# Altium schematic sheet FPGA1.SchDoc
size A1
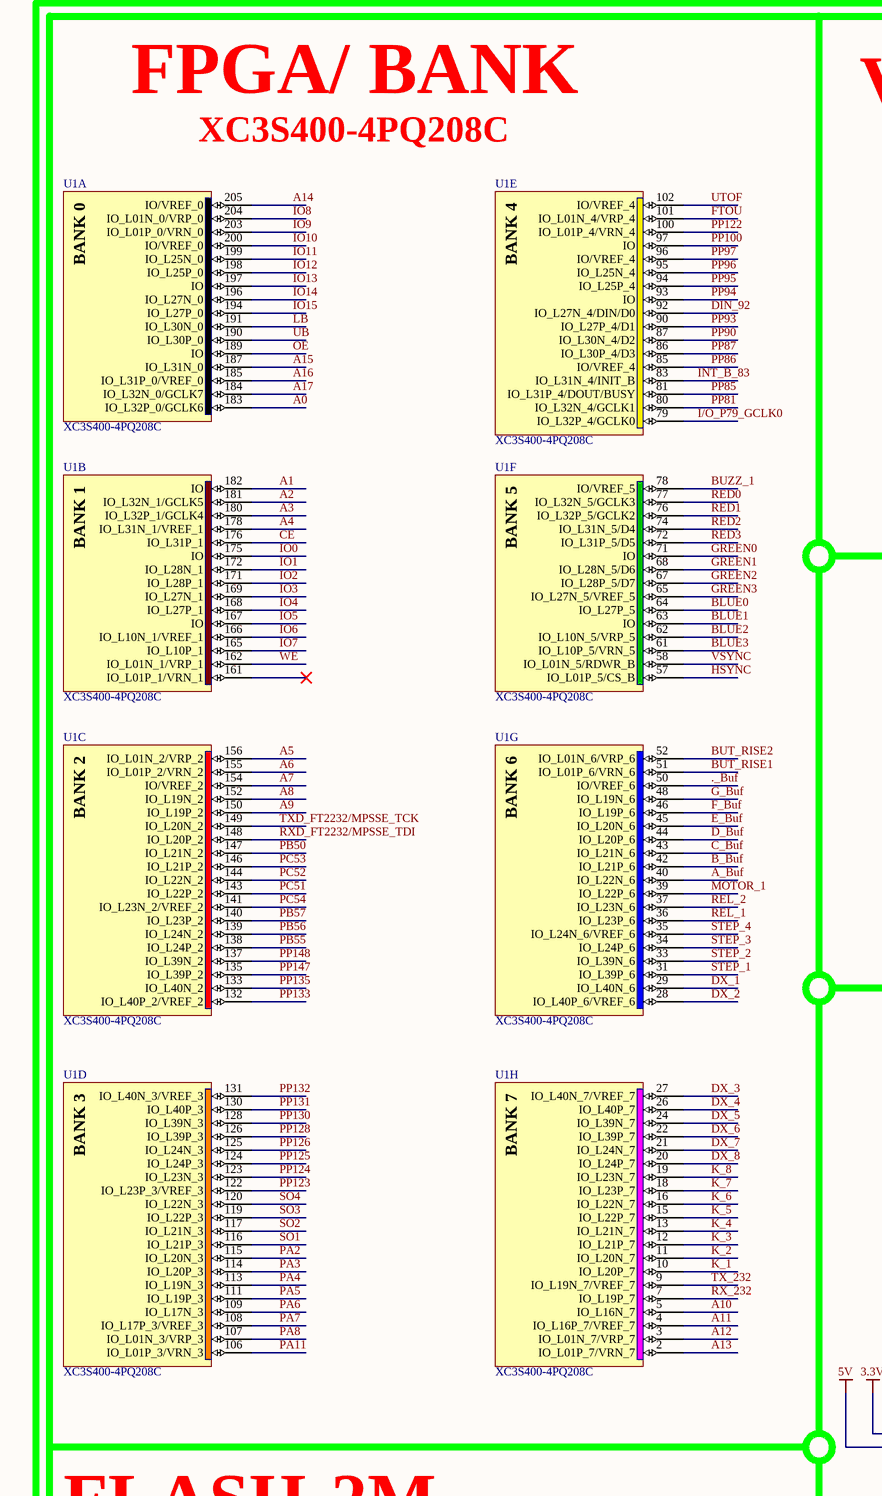
[diagram p0: FPGA1.SchDoc, top left]
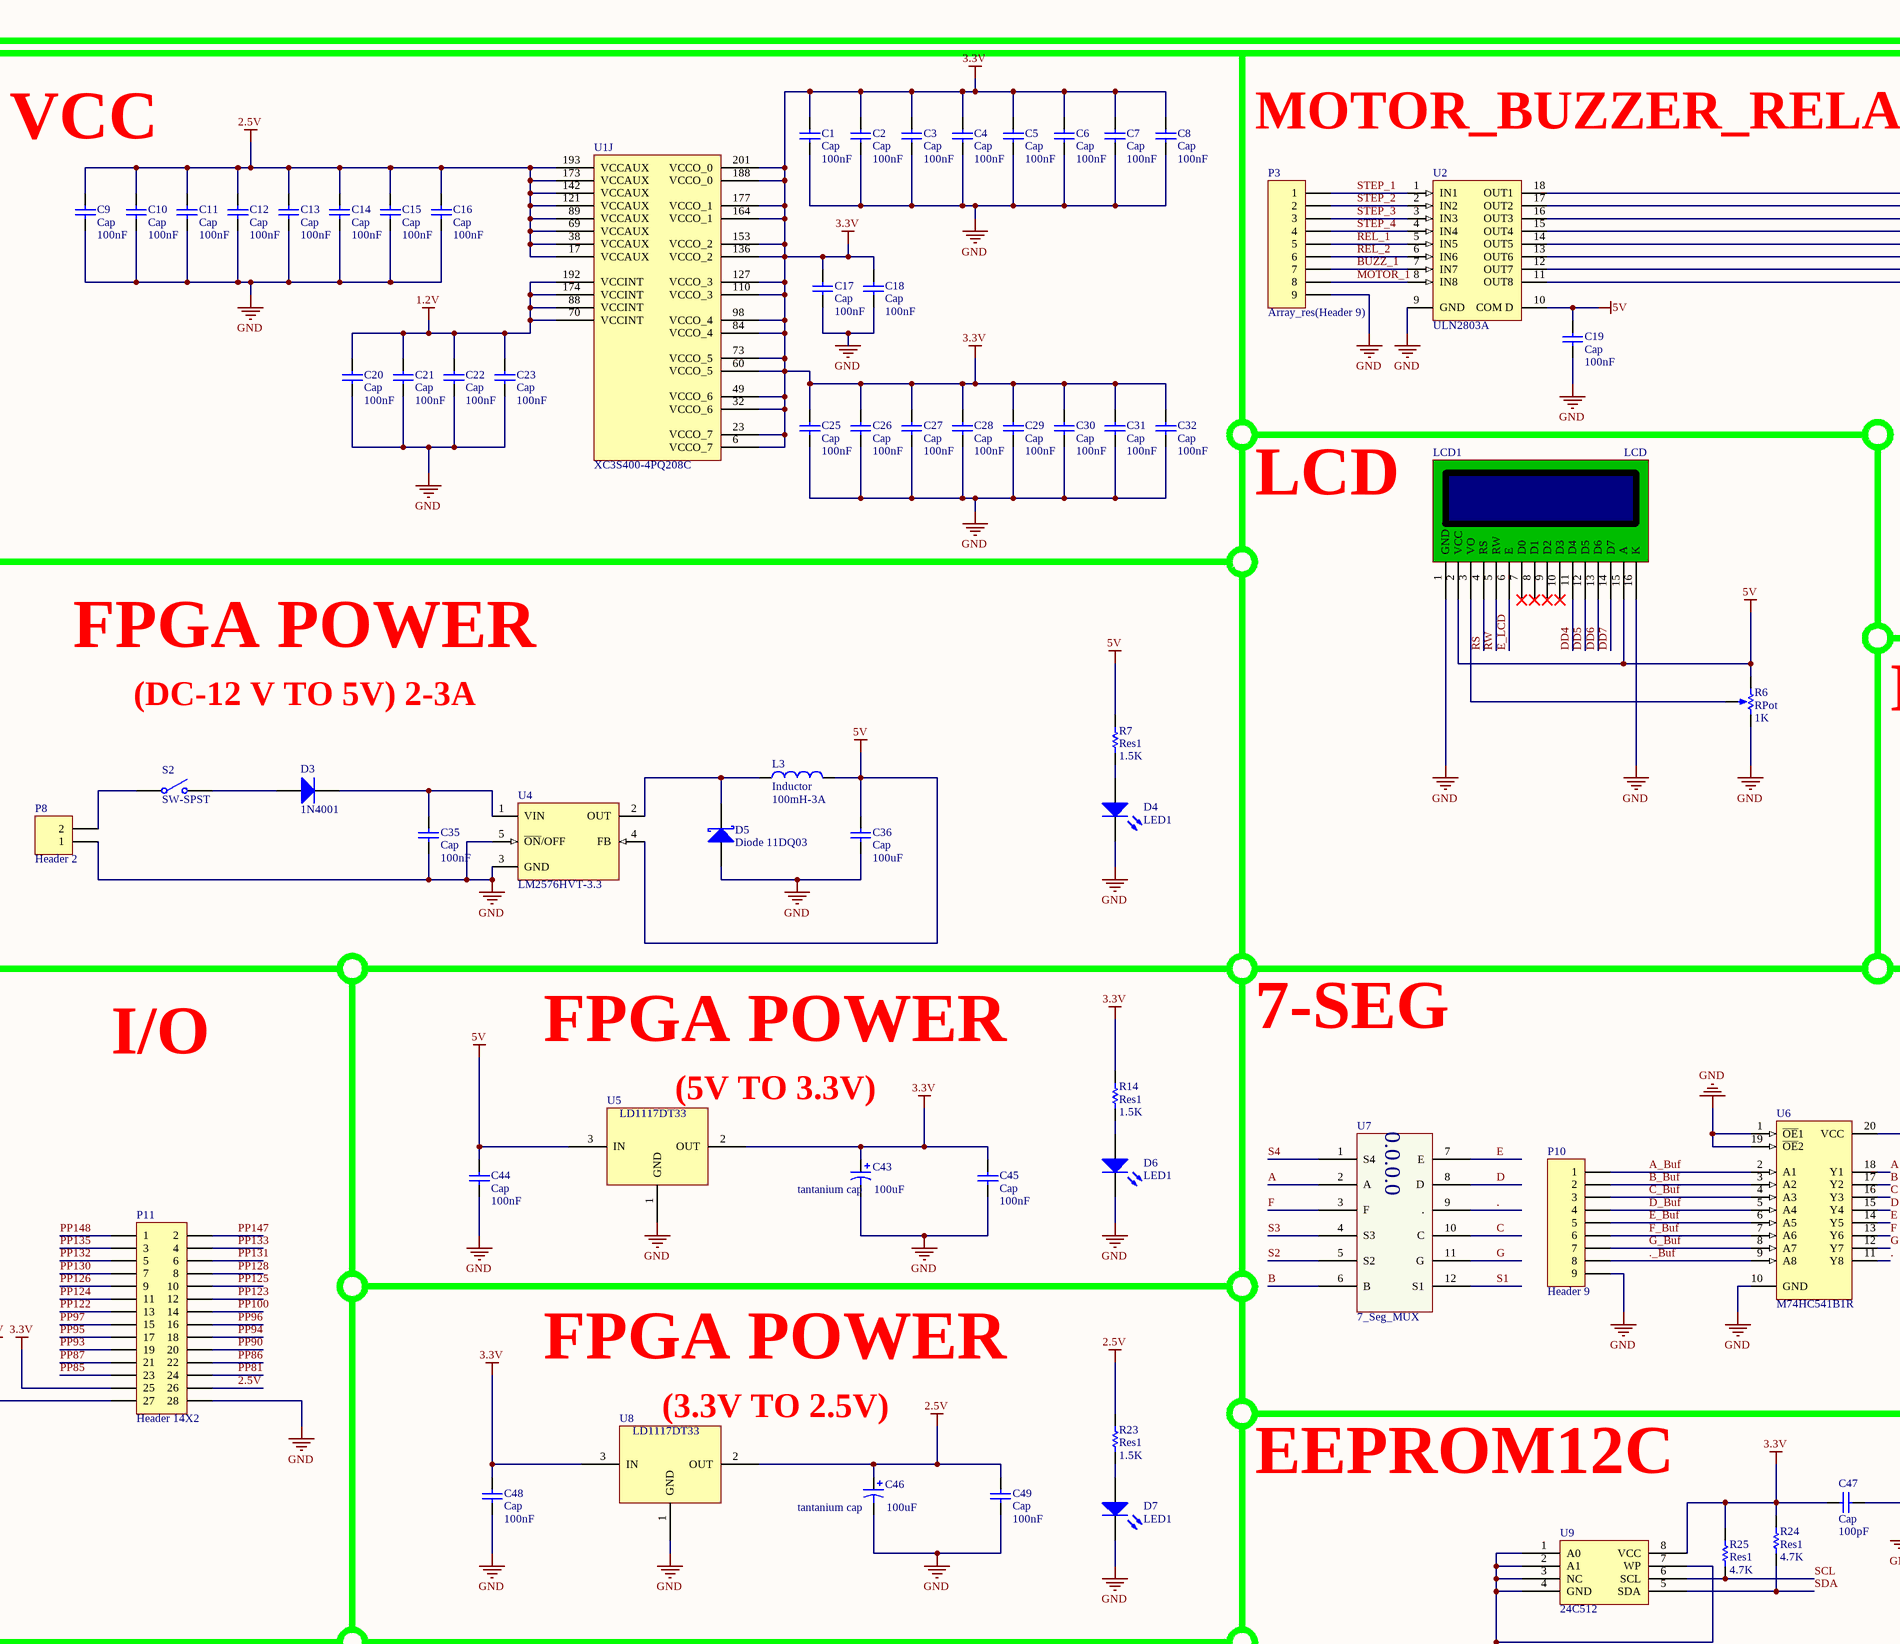
[diagram p1: FPGA1.SchDoc, top middle]
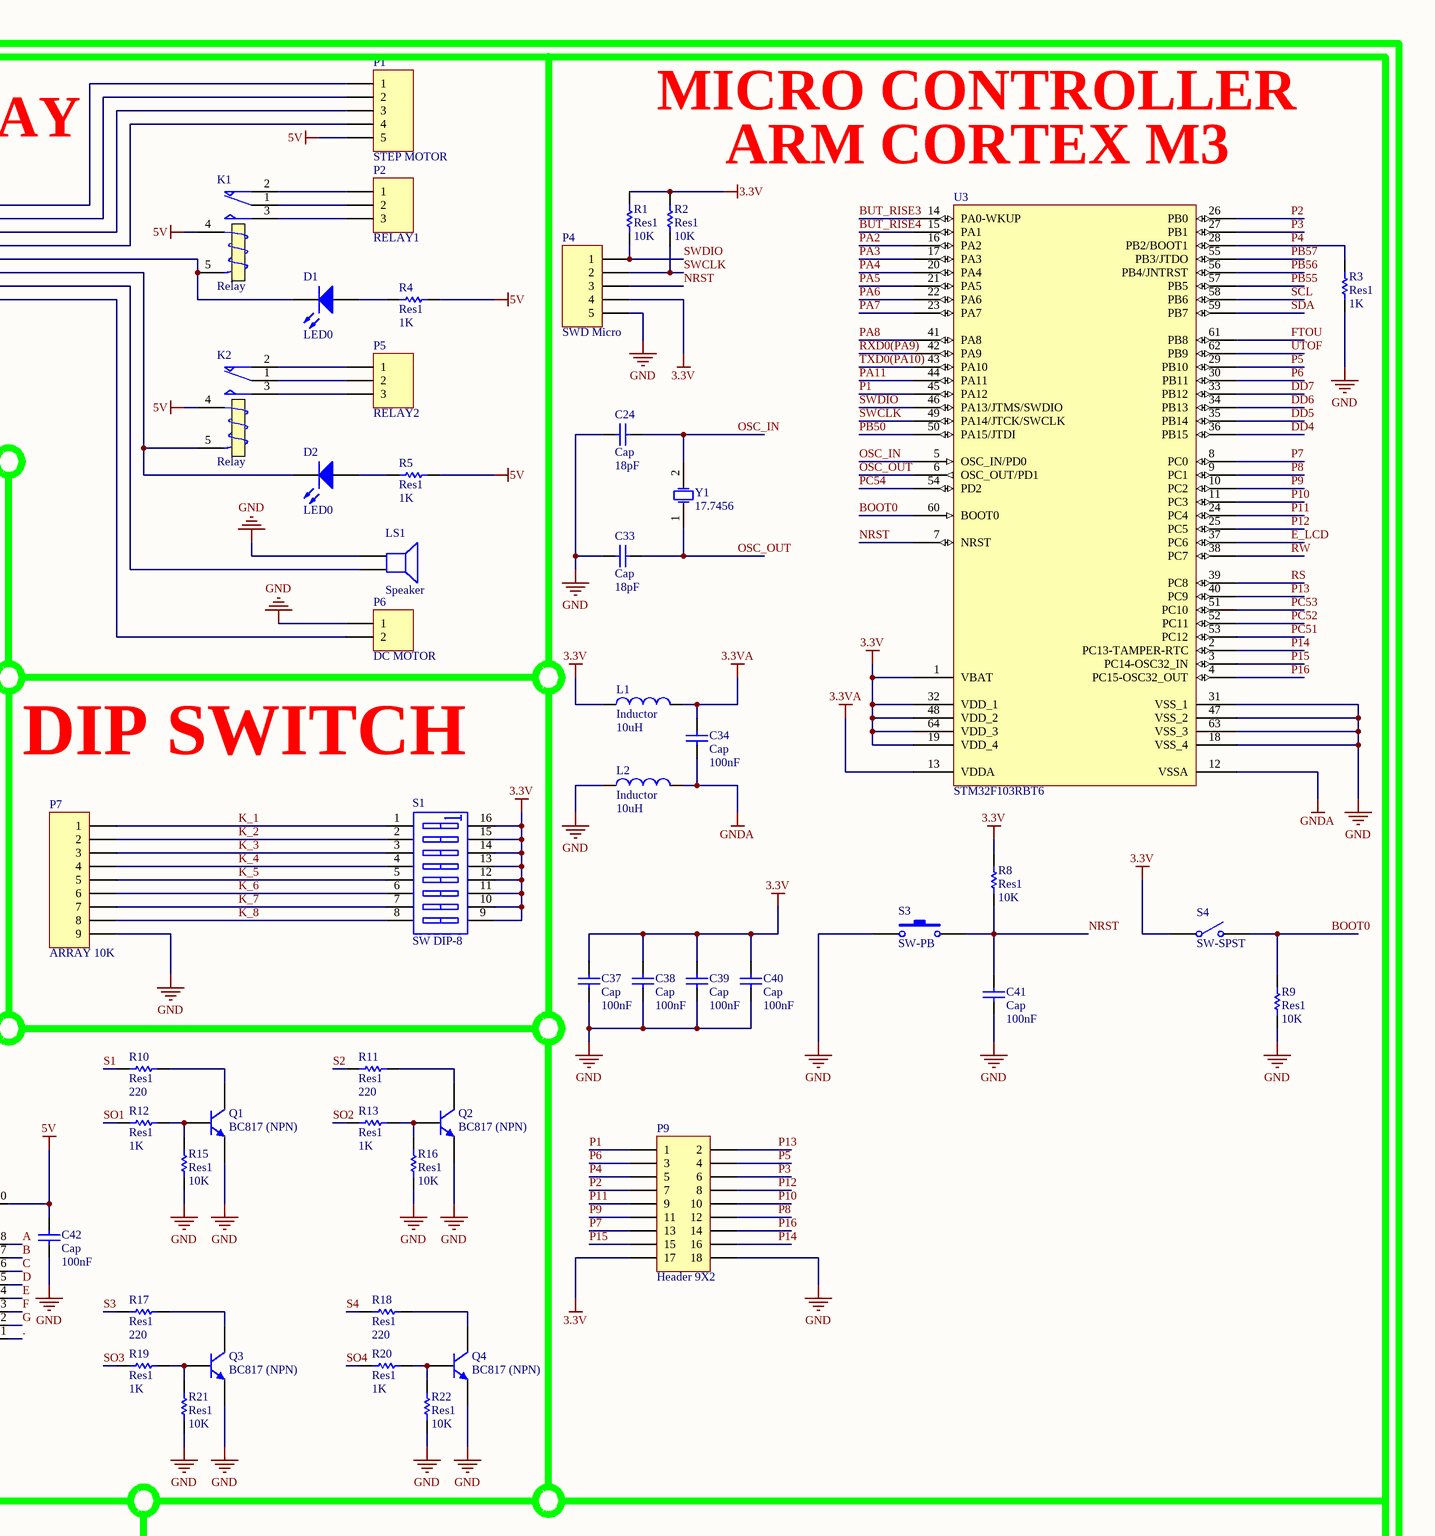
[diagram p2: FPGA1.SchDoc, top right]
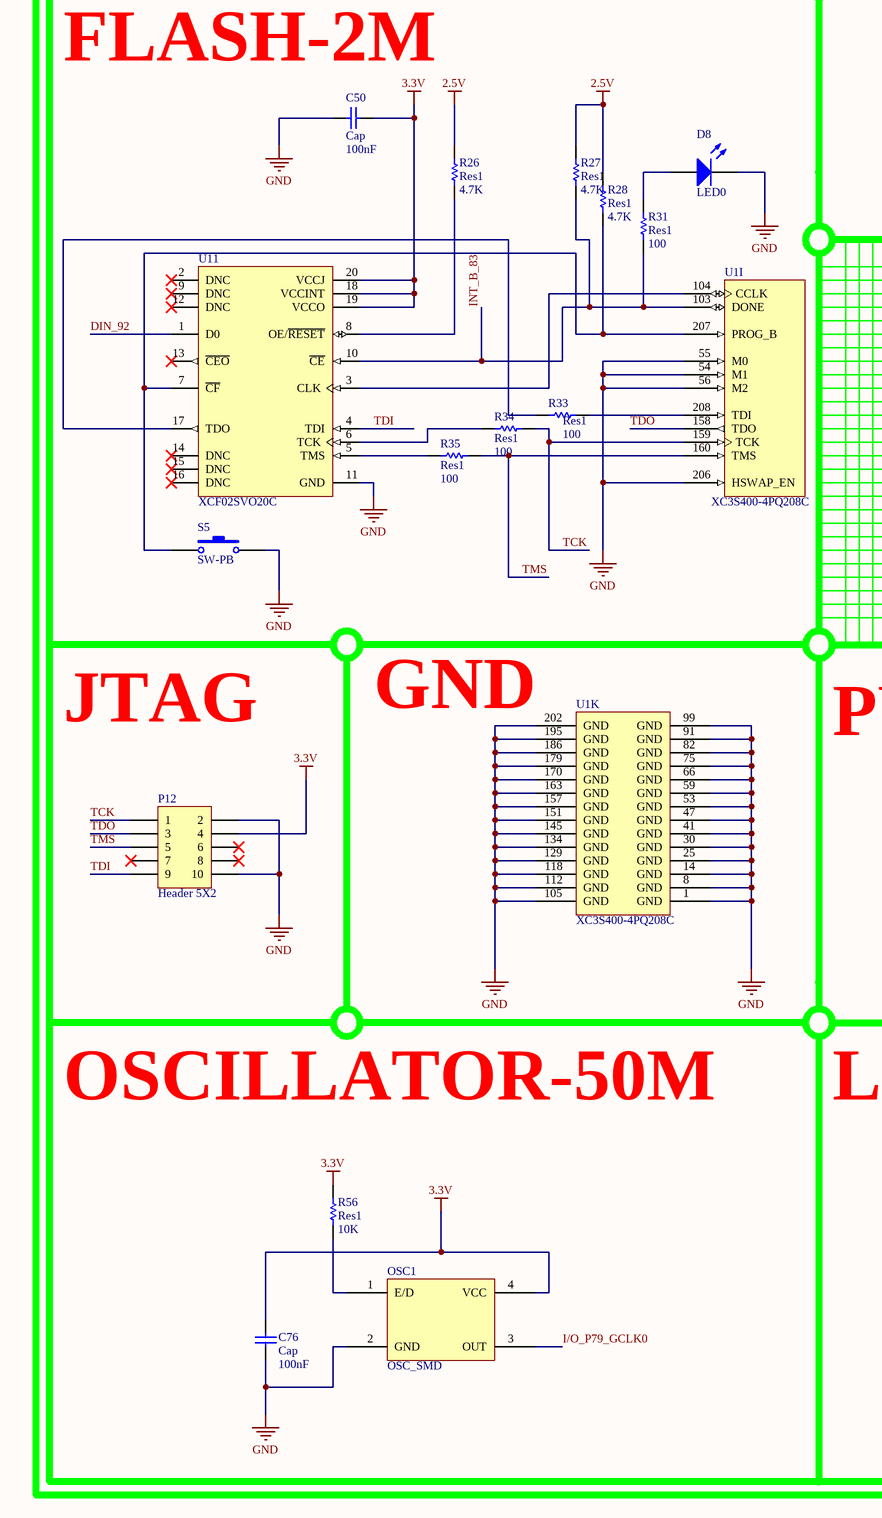
[diagram p3: FPGA1.SchDoc, bottom left]
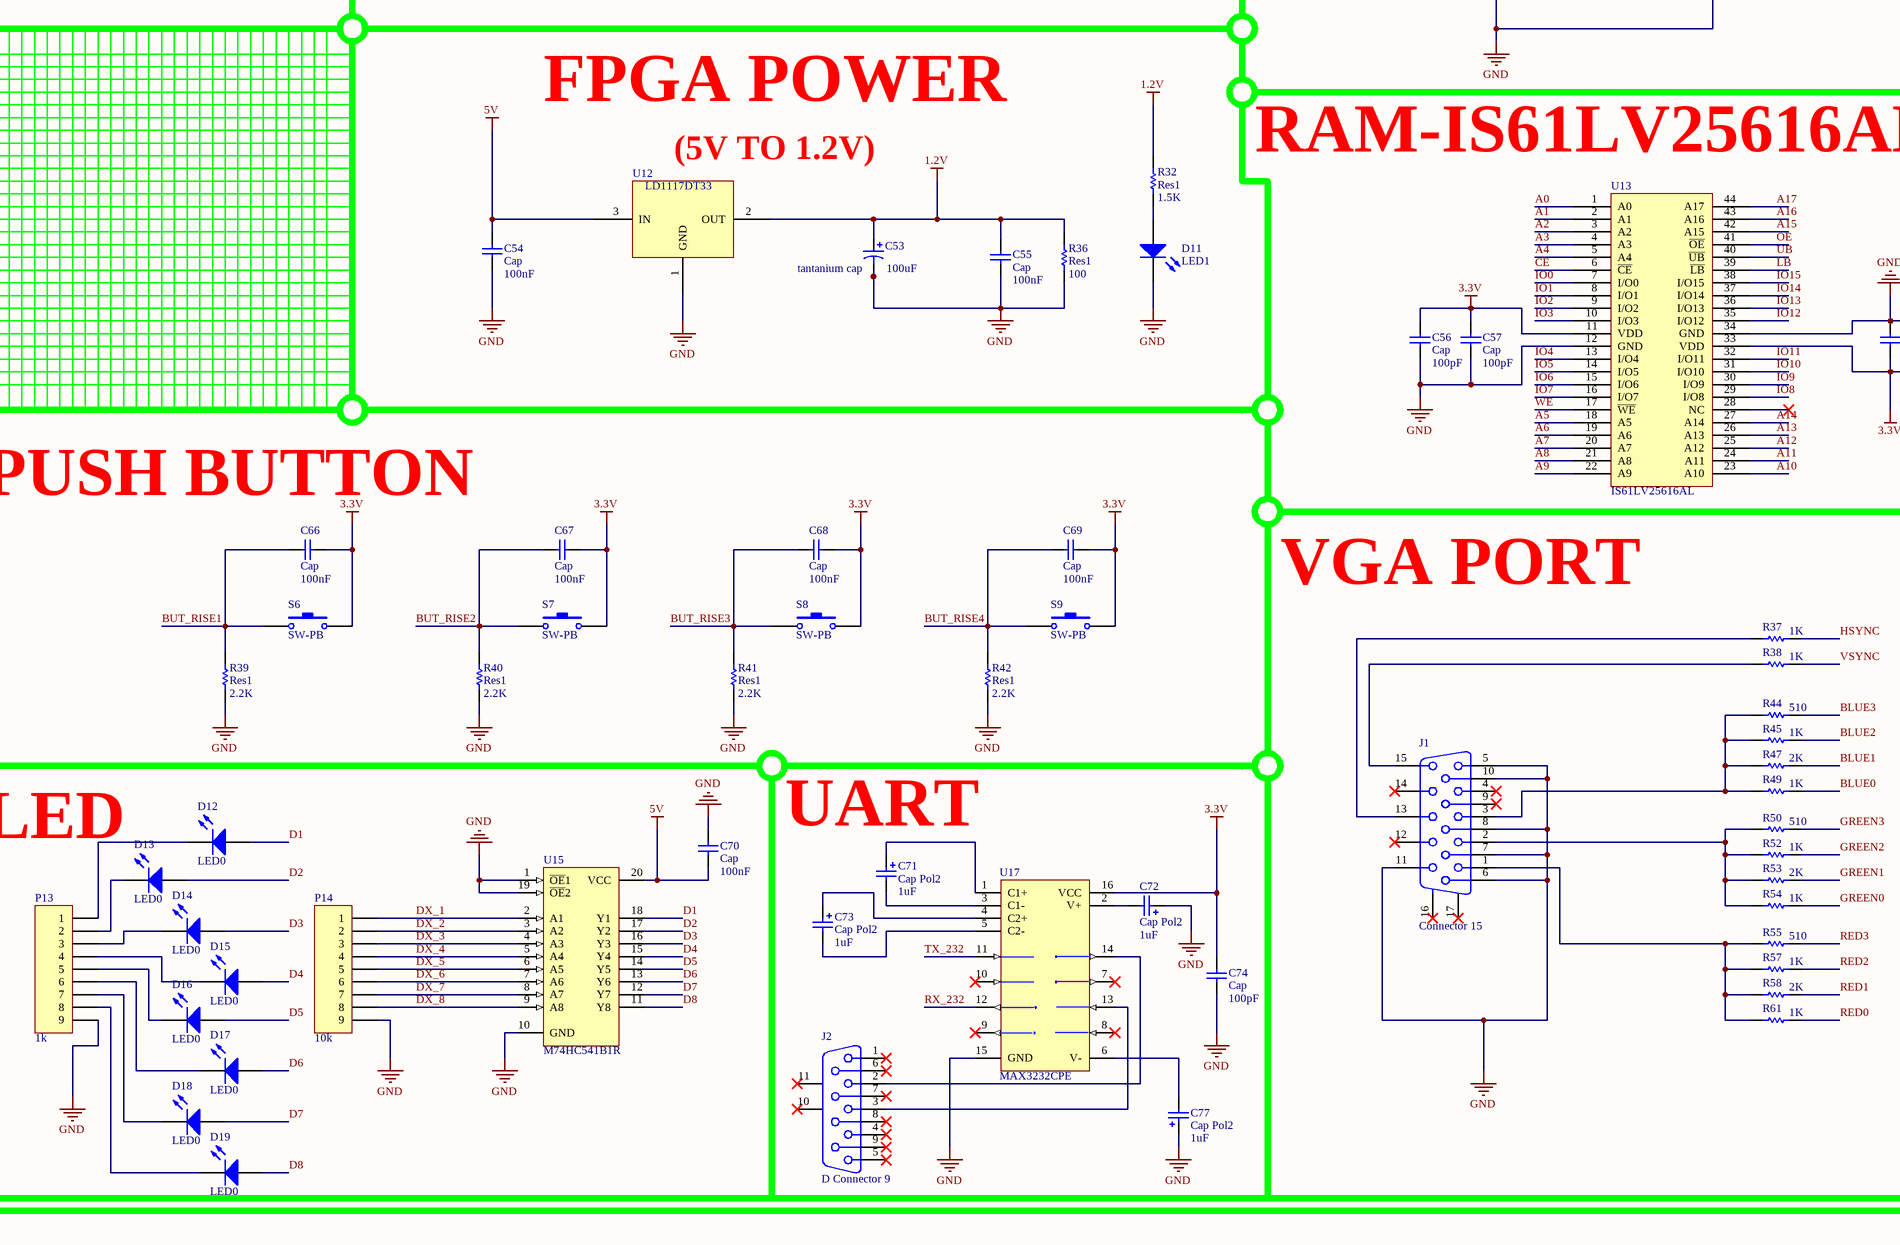
[diagram p4: FPGA1.SchDoc, bottom middle]
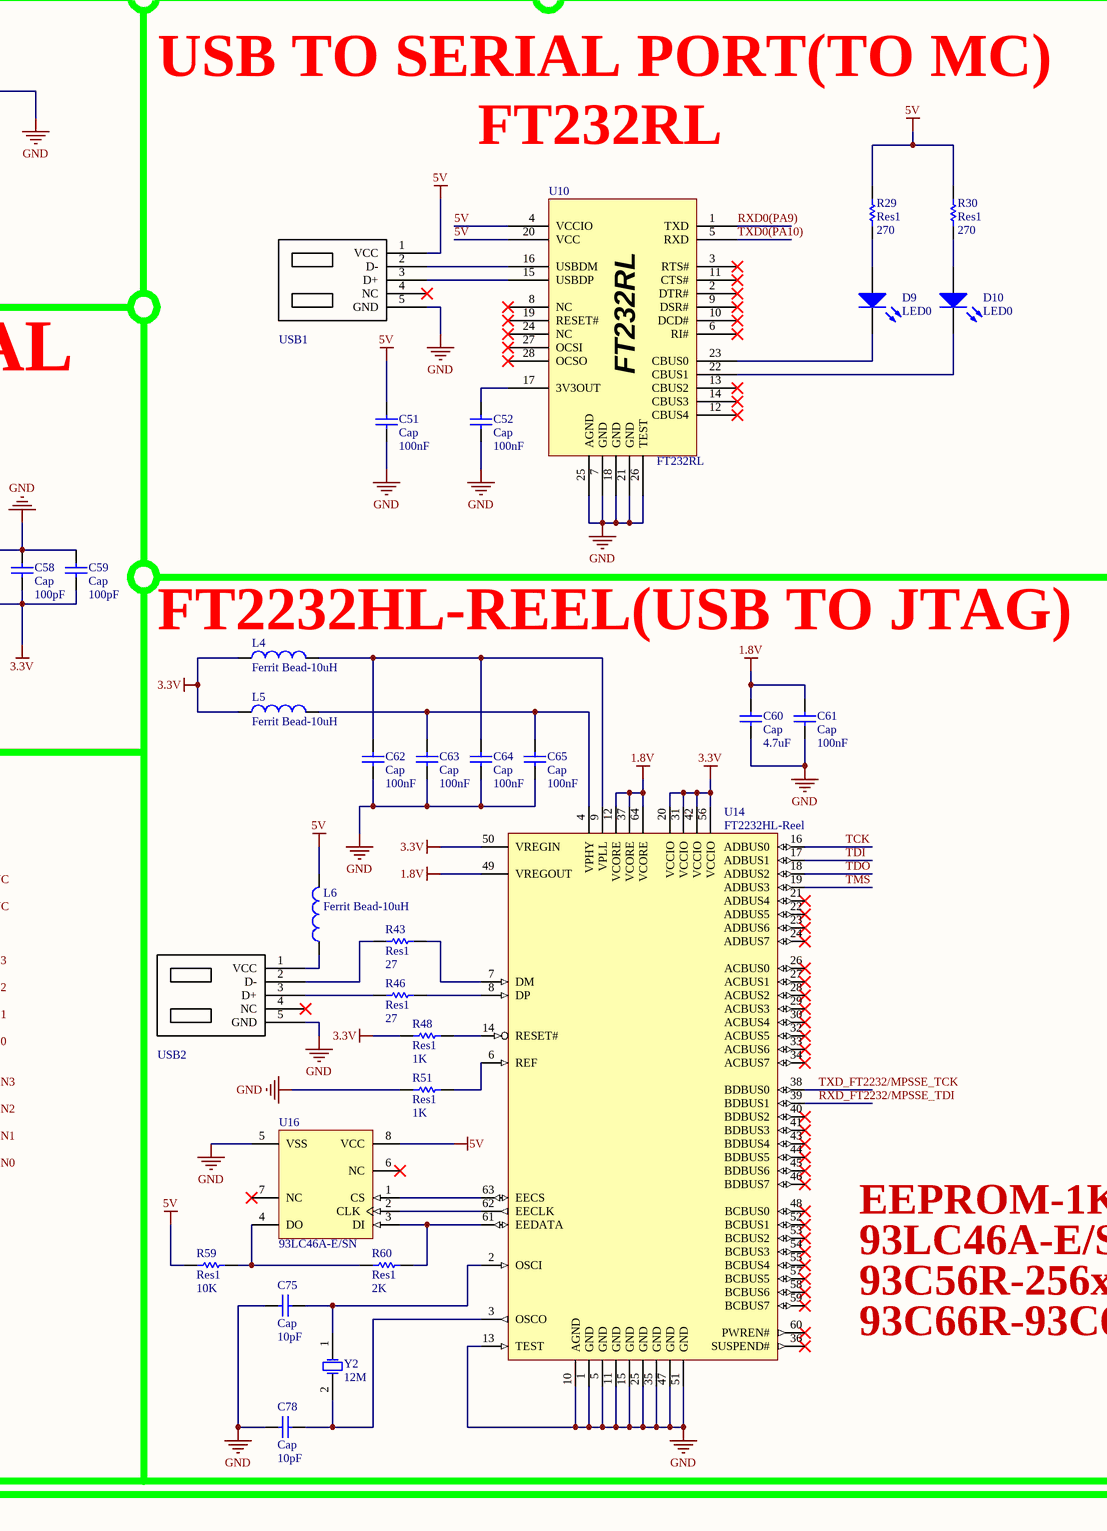
[diagram p5: FPGA1.SchDoc, bottom right]

## Parts
C1  Cap  value 100nF  [SMD_805]
C2  Cap  value 100nF  [SMD_805]
C3  Cap  value 100nF  [SMD_805]
C4  Cap  value 100nF  [SMD_805]
C5  Cap  value 100nF  [SMD_805]
C6  Cap  value 100nF  [SMD_805]
C7  Cap  value 100nF  [SMD_805]
C8  Cap  value 100nF  [SMD_805]
C9  Cap  value 100nF  [SMD_805]
C10  Cap  value 100nF  [SMD_805]
C11  Cap  value 100nF  [SMD_805]
C12  Cap  value 100nF  [SMD_805]
C13  Cap  value 100nF  [SMD_805]
C14  Cap  value 100nF  [SMD_805]
C15  Cap  value 100nF  [SMD_805]
C16  Cap  value 100nF  [SMD_805]
C17  Cap  value 100nF  [SMD_805]
C18  Cap  value 100nF  [SMD_805]
C19  Cap  value 100nF  [SMD_805]
C20  Cap  value 100nF  [SMD_805]
C21  Cap  value 100nF  [SMD_805]
C22  Cap  value 100nF  [SMD_805]
C23  Cap  value 100nF  [SMD_805]
C24  Cap  value 18pF  [SMD_805]
C25  Cap  value 100nF  [SMD_805]
C26  Cap  value 100nF  [SMD_805]
C27  Cap  value 100nF  [SMD_805]
C28  Cap  value 100nF  [SMD_805]
C29  Cap  value 100nF  [SMD_805]
C30  Cap  value 100nF  [SMD_805]
C31  Cap  value 100nF  [SMD_805]
C32  Cap  value 100nF  [SMD_805]
C33  Cap  value 18pF  [SMD_805]
C34  Cap  value 100nF  [SMD_805]
C35  Cap  value 100nF  [C_CYL_SMD2]
C36  Cap  value 100uF  [C_CYL_SMD]
C37  Cap  value 100nF  [SMD_805]
C38  Cap  value 100nF  [SMD_805]
C39  Cap  value 100nF  [SMD_805]
C40  Cap  value 100nF  [SMD_805]
C41  Cap  value 100nF  [SMD_805]
C42  Cap  value 100nF  [SMD_805]
C43  tantanium cap  value 100uF  [C_B]
C44  Cap  value 100nF  [SMD_805]
C45  Cap  value 100nF  [SMD_805]
C46  tantanium cap  value 100uF  [C_B]
C47  Cap  value 100pF  [SMD_805]
C48  Cap  value 100nF  [SMD_805]
C49  Cap  value 100nF  [SMD_805]
C50  Cap  value 100nF  [SMD_805]
C51  Cap  value 100nF  [SMD_805]
C52  Cap  value 100nF  [SMD_805]
C53  tantanium cap  value 100uF  [C_B]
C54  Cap  value 100nF  [SMD_805]
C55  Cap  value 100nF  [SMD_805]
C56  Cap  value 100pF  [SMD_805]
C57  Cap  value 100pF  [SMD_805]
C58  Cap  value 100pF  [SMD_805]
C59  Cap  value 100pF  [SMD_805]
C60  Cap  value 4.7uF  [SMD_805]
C61  Cap  value 100nF  [SMD_805]
C62  Cap  value 100nF  [SMD_805]
C63  Cap  value 100nF  [SMD_805]
C64  Cap  value 100nF  [SMD_805]
C65  Cap  value 100nF  [SMD_805]
C66  Cap  value 100nF  [SMD_805]
C67  Cap  value 100nF  [SMD_805]
C68  Cap  value 100nF  [SMD_805]
C69  Cap  value 100nF  [SMD_805]
C70  Cap  value 100nF  [SMD_805]
C71  Cap Pol2  value 1uF  [C_B]
C72  Cap Pol2  value 1uF  [C_B]
C73  Cap Pol2  value 1uF  [C_B]
C74  Cap  value 100pF  [SMD_805]
C75  Cap  value 10pF  [SMD_805]
C76  Cap  value 100nF  [SMD_805]
C77  Cap Pol2  value 1uF  [C_B]
C78  Cap  value 10pF  [SMD_805]
D1  LED0  [LED1206GRN]
D2  LED0  [LED1206GRN]
D3  1N4001  [TVS]
D4  LED1  [Led0805]
D5  Diode 11DQ03  [1N5822]
D6  LED1  [Led0805]
D7  LED1  [Led0805]
D8  LED0  [LED0805GRN]
D9  LED0  [LED0805GRN]
D10  LED0  [LED0805GRN]
D11  LED1  [Led0805]
D12  LED0  [LED1206RED]
D13  LED0  [LED1206RED]
D14  LED0  [LED1206RED]
D15  LED0  [LED1206RED]
D16  LED0  [LED1206RED]
D17  LED0  [LED1206RED]
D18  LED0  [LED1206RED]
D19  LED0  [LED1206RED]
J1  Connector 15  [DSUB_15RF]
J2  D Connector 9  [COM_3d]
K1  Relay  [REL_SPDT_5_1512]
K2  Relay  [REL_SPDT_5_1512]
L1  Inductor  value 10uH  [smd_805]
L2  Inductor  value 10uH  [smd_805]
L3  Inductor  value 100mH-3A  [INDUC_SMD]
L4  Ferrit Bead-10uH  [smd_805]
L5  Ferrit Bead-10uH  [smd_805]
L6  Ferrit Bead-10uH  [smd_805]
LCD1  LCD  [LCD2x16_3d]
LS1  Speaker  [BZ_C9]
OSC1  OSC_SMD  [OSC_SMD]
P1  STEP MOTOR  [HDR_M_1X5]
P2  RELAY1  [HDR_M_1X3]
P3  Array_res(Header 9)  [Aray 9]
P4  SWD Micro  [HDR_M_1X5]
P5  RELAY2  [HDR_M_1X3]
P6  DC MOTOR  [HDR_F_1X2]
P7  ARRAY 10K  [Aray 9]
P8  Header 2  [ADAP_JACK]
P9  Header 9X2  [HDR_M_2X9]
P10  Header 9  [Aray 9]
P11  Header 14X2  [HDR_M_2X14]
P12  Header 5X2  [BOX2x5]
P13  1k  [Aray 9]
P14  10k  [Aray 9]
Q1  BC817 (NPN)  [SOT-23]
Q2  BC817 (NPN)  [SOT-23]
Q3  BC817 (NPN)  [SOT-23]
Q4  BC817 (NPN)  [SOT-23]
R1  Res1  value 10K  [SMD_805]
R2  Res1  value 10K  [SMD_805]
R3  Res1  value 1K  [SMD_805]
R4  Res1  value 1K  [SMD_805]
R5  Res1  value 1K  [SMD_805]
R6  RPot  value 1K  [POT_3296Y]
R7  Res1  value 1.5K  [SMD_805]
R8  Res1  value 10K  [SMD_805]
R9  Res1  value 10K  [SMD_805]
R10  Res1  value 220  [SMD_805]
R11  Res1  value 220  [SMD_805]
R12  Res1  value 1K  [SMD_805]
R13  Res1  value 1K  [SMD_805]
R14  Res1  value 1.5K  [SMD_805]
R15  Res1  value 10K  [SMD_805]
R16  Res1  value 10K  [SMD_805]
R17  Res1  value 220  [SMD_805]
R18  Res1  value 220  [SMD_805]
R19  Res1  value 1K  [SMD_805]
R20  Res1  value 1K  [SMD_805]
R21  Res1  value 10K  [SMD_805]
R22  Res1  value 10K  [SMD_805]
R23  Res1  value 1.5K  [SMD_805]
R24  Res1  value 4.7K  [SMD_805]
R25  Res1  value 4.7K  [SMD_805]
R26  Res1  value 4.7K  [SMD_805]
R27  Res1  value 4.7K  [SMD_805]
R28  Res1  value 4.7K  [SMD_805]
R29  Res1  value 270  [SMD_805]
R30  Res1  value 270  [SMD_805]
R31  Res1  value 100  [SMD_805]
R32  Res1  value 1.5K  [SMD_805]
R33  Res1  value 100  [SMD_805]
R34  Res1  value 100  [SMD_805]
R35  Res1  value 100  [SMD_805]
R36  Res1  value 100  [SMD_805]
R37  value 1K  [SMD_805]
R38  value 1K  [SMD_805]
R39  Res1  value 2.2K  [SMD_805]
R40  Res1  value 2.2K  [SMD_805]
R41  Res1  value 2.2K  [SMD_805]
R42  Res1  value 2.2K  [SMD_805]
R43  Res1  value 27  [SMD_805]
R44  value 510  [SMD_805]
R45  value 1K  [SMD_805]
R46  Res1  value 27  [SMD_805]
R47  value 2K  [SMD_805]
R48  Res1  value 1K  [SMD_805]
R49  value 1K  [SMD_805]
R50  value 510  [SMD_805]
R51  Res1  value 1K  [SMD_805]
R52  value 1K  [SMD_805]
R53  value 2K  [SMD_805]
R54  value 1K  [SMD_805]
R55  value 510  [SMD_805]
R56  Res1  value 10K  [SMD_805]
R57  value 1K  [SMD_805]
R58  value 2K  [SMD_805]
R59  Res1  value 10K  [SMD_805]
R60  Res1  value 2K  [SMD_805]
R61  value 1K  [SMD_805]
S1  SW DIP-8  [DIPSW254_8]
S2  SW-SPST  [SWTOG_SPDT_R_7101MD9]
S3  SW-PB  [SWPBS_SPST_6X3X2]
S4  SW-SPST  [KEY1]
S5  SW-PB  [SWPBS_SPST_6X3X2]
S6  SW-PB  [SWPBT_SPST_6X6X5]
S7  SW-PB  [SWPBT_SPST_6X6X5]
S8  SW-PB  [SWPBT_SPST_6X6X5]
S9  SW-PB  [SWPBT_SPST_6X6X5]
U1  XC3S400-4PQ208C  [XC3S400_PQ208]  (parts A,B,C,D,E,F,G,H,I,J,K of 11)
U2  ULN2803A  [SOL18]
U3  STM32F103RBT6  [LQFP64_L]
U4  LM2576HVT-3.3  [LM2576_SMD]
U5  LD1117DT33  [SOT223]
U6  M74HC541B1R  [SO_20_W]
U7  7_Seg_MUX  [S7_MUX]
U8  LD1117DT33  [SOT223]
U9  24C512  [SO_8]
U10  FT232RL  [SO_28_W]
U11  XCF02SVO20C  [XCF02S]
U12  LD1117DT33  [SOT223]
U13  IS61LV25616AL  [SOG80_44]
U14  FT2232HL-Reel  [LQFP-64_N]
U15  M74HC541B1R  [DIP_20]
U16  93LC46A-E/SN  [SO_8]
U17  MAX3232CPE  [SO_16]
USB1  MICRO_USB  [MINI_USB_NEW]  (value not drawn)
USB2  MICRO_USB  [MINI_USB_NEW]  (value not drawn)
Y1  17.7456  [XTLT_RTC_ST]
Y2  12M  [XTAL_SMD]

## Nets
1.2V: C20.2 C21.2 C22.2 C23.2 C53.1 C55.2 R32.2 R36.2 U1.70(VCCINT) U1.88(VCCINT) U1.174(VCCINT) U1.192(VCCINT) U12.2(OUT)
1.8V: C60.2 C61.2 U14.12(VCORE) U14.37(VCORE) U14.49(VREGOUT) U14.64(VCORE)
2.5V: C9.2 C10.2 C11.2 C12.2 C13.2 C14.2 C15.2 C16.2 C46.1 C49.2 P11.26 R23.2 R26.2 R27.2 R28.2 U1.17(VCCAUX) U1.38(VCCAUX) U1.69(VCCAUX) U1.89(VCCAUX) U1.121(VCCAUX) U1.142(VCCAUX) U1.173(VCCAUX) U1.193(VCCAUX) U8.2(OUT)
3.3V: C1.2 C2.2 C3.2 C4.2 C5.2 C6.2 C7.2 C8.2 C17.2 C18.2 C25.2 C26.2 C27.2 C28.2 C29.2 C30.2 C31.2 C32.2 C37.2 C38.2 C39.2 C40.2 C43.1 C45.2 C47.2 C48.2 C50.2 C56.2 C57.2 C58.1 C59.1 C66.1 C67.1 C68.1 C69.1 C74.2 C76.2 L1.1 L4.1 L5.1 OSC1.4(VCC) P4.4 P9.17 P11.25 P12.4 R1.2 R2.2 R8.2 R14.2 R24.1 R25.1 R48.1 R56.2 S1.9(B8) S1.10(B7) S1.11(B6) S1.12(B5) S1.13(B4) S1.14(B3) S1.15(B2) S1.16(B1) S4.1(COMMON) S6.2 S7.2 S8.2 S9.2 U1.6(VCCO_7) U1.23(VCCO_7) U1.32(VCCO_6) U1.49(VCCO_6) U1.60(VCCO_5) U1.73(VCCO_5) U1.84(VCCO_4) U1.98(VCCO_4) U1.110(VCCO_3) U1.127(VCCO_3) U1.136(VCCO_2) U1.153(VCCO_2) U1.164(VCCO_1) U1.177(VCCO_1) U1.188(VCCO_0) U1.201(VCCO_0) U3.1(VBAT) U3.19(VDD_4) U3.32(VDD_1) U3.48(VDD_2) U3.64(VDD_3) U5.2(OUT) U8.3(IN) U9.8(VCC) U11.18(VCCINT) U11.19(VCCO) U11.20(VCCJ) U13.11(VDD) U13.33(VDD) U14.20(VCCIO) U14.31(VCCIO) U14.42(VCCIO) U14.50(VREGIN) U14.56(VCCIO) U17.16(VCC)
3.3VA: C34.2 L1.2 U3.13(VDDA)
5V: C19.2 C36.2 C42.2 C44.2 C51.2 C54.2 C70.1 K1.4(T1) K2.4(T1) L3.2 L6.2 LCD1.2(VCC) LCD1.15(A) P1.5 P11.27 R4.2 R5.2 R6.1(TOP) R7.2 R29.2 R30.2 R59.1 U2.10(COM_D) U4.4(FB) U5.3(IN) U6.20(VCC) U10.4(VCCIO) U10.20(VCC) U12.3(IN) U15.20(VCC) U16.8(VCC) USB1.1(VCC)
GND: C1.1 C2.1 C3.1 C4.1 C5.1 C6.1 C7.1 C8.1 C9.1 C10.1 C11.1 C12.1 C13.1 C14.1 C15.1 C16.1 C17.1 C18.1 C19.1 C20.1 C21.1 C22.1 C23.1 C24.1 C25.1 C26.1 C27.1 C28.1 C29.1 C30.1 C31.1 C32.1 C33.1 C35.1 C36.1 C37.1 C38.1 C39.1 C40.1 C41.1 C42.1 C43.2 C44.1 C45.1 C46.2 C47.1 C48.1 C49.1 C50.1 C51.1 C52.1 C53.2 C54.1 C55.1 C56.1 C57.1 C58.2 C59.2 C60.1 C61.1 C62.1 C63.1 C64.1 C65.1 C70.2 C72.1 C74.1 C75.1 C76.1 C77.1 C78.1 D4.2(K) D5.1(A) D6.2(K) D7.2(K) D8.2(K) D11.2(K) J1.5 J1.6 J1.7 J1.8 J1.10 J1.11 L2.1 LCD1.1(GND) LCD1.16(K) LS1.1 OSC1.2(GND) P3.9 P4.5 P6.1 P7.9 P8.1 P9.18 P10.9 P11.28 P12.2 P12.10 P13.9 P14.9 Q1.1(B) Q2.1(B) Q3.1(B) Q4.1(B) R3.1 R6.2(BOT) R9.1 R15.2 R16.2 R21.2 R22.2 R36.1 R39.1 R40.1 R41.1 R42.1 R51.1 S3.1 S5.2 U1.1(GND) U1.8(GND) U1.14(GND) U1.25(GND) U1.30(GND) U1.41(GND) U1.47(GND) U1.53(GND) U1.54(M1) U1.55(M0) U1.56(M2) U1.59(GND) U1.66(GND) U1.75(GND) U1.82(GND) U1.91(GND) U1.99(GND) U1.105(GND) U1.112(GND) U1.118(GND) U1.129(GND) U1.134(GND) U1.145(GND) U1.151(GND) U1.157(GND) U1.163(GND) U1.170(GND) U1.179(GND) U1.186(GND) U1.195(GND) U1.202(GND) U1.206(HSWAP_EN) U2.9(GND) U3.18(VSS_4) U3.31(VSS_1) U3.47(VSS_2) U3.63(VSS_3) U4.3(GND) U4.5(~{ON}/OFF) U5.1(GND) U6.1(~{OE}1) U6.10(GND) U6.19(~{OE}2) U8.1(GND) U9.1(A0) U9.2(A1) U9.3(NC) U9.4(GND) U9.7(WP) U10.7(GND) U10.18(GND) U10.21(GND) U10.25(AGND) U10.26(TEST) U11.11(GND) U12.1(GND) U13.12(GND) U13.34(GND) U14.1(GND) U14.5(GND) U14.10(AGND) U14.11(GND) U14.13(TEST) U14.15(GND) U14.25(GND) U14.35(GND) U14.47(GND) U14.51(GND) U15.1(~{OE}1) U15.10(GND) U15.19(~{OE}2) U16.5(VSS) U17.15(GND) USB1.5(GND) USB2.5(GND)
GNDA: C34.1 L2.2 U3.12(VSSA)
.: U6.11(Y8) U7.9(.)
._Buf: P10.8 U1.50(IO/VREF_6) U6.9(A8)
A: U6.18(Y1) U7.2(A)
A0: U1.183(IO_L32P_0/GCLK6) U13.1(A0)
A1: U1.182(IO) U13.2(A1)
A2: U1.181(IO_L32N_1/GCLK5) U13.3(A2)
A3: U1.180(IO_L32P_1/GCLK4) U13.4(A3)
A4: U1.178(IO_L31N_1/VREF_1) U13.5(A4)
A5: U1.156(IO_L01N_2/VRP_2) U13.18(A5)
A6: U1.155(IO_L01P_2/VRN_2) U13.19(A6)
A7: U1.154(IO/VREF_2) U13.20(A7)
A8: U1.152(IO_L19N_2) U13.21(A8)
A9: U1.150(IO_L19P_2) U13.22(A9)
A10: U1.5(IO_L16N_7) U13.23(A10)
A11: U1.4(IO_L16P_7/VREF_7) U13.24(A11)
A12: U1.3(IO_L01N_7/VRP_7) U13.25(A12)
A13: U1.2(IO_L01P_7/VRN_7) U13.26(A13)
A14: U1.205(IO/VREF_0) U13.27(A14)
A15: U1.187(IO_L31N_0) U13.42(A15)
A16: U1.185(IO_L31P_0/VREF_0) U13.43(A16)
A17: U1.184(IO_L32N_0/GCLK7) U13.44(A17)
A_Buf: P10.1 U1.40(IO_L22N_6) U6.2(A1)
B: U6.17(Y2) U7.6(B)
B_Buf: P10.2 U1.42(IO_L21P_6) U6.3(A2)
BLUE0: R49.2 U1.64(IO_L27P_5)
BLUE1: R47.2 U1.63(IO)
BLUE2: R45.2 U1.62(IO_L10N_5/VRP_5)
BLUE3: R44.2 U1.61(IO_L10P_5/VRN_5)
BOOT0: R9.2 S4.2(NO) U3.60(BOOT0)
BUT_RISE1: C66.2 R39.2 S6.1 U1.51(IO_L01P_6/VRN_6)
BUT_RISE2: C67.2 R40.2 S7.1 U1.52(IO_L01N_6/VRP_6)
BUT_RISE3: C68.2 R41.2 S8.1 U3.14(PA0-WKUP)
BUT_RISE4: C69.2 R42.2 S9.1 U3.15(PA1)
BUZZ_1: P3.7 U1.78(IO/VREF_5) U2.7(IN7)
C: U6.16(Y3) U7.10(C)
C_Buf: P10.3 U1.43(IO_L21N_6) U6.4(A3)
CE: U1.176(IO_L31P_1) U13.6(~{CE})
D: U6.15(Y4) U7.8(D)
D1: D12.1(A) U15.18(Y1)
D2: D13.1(A) U15.17(Y2)
D3: D14.1(A) U15.16(Y3)
D4: D15.1(A) U15.15(Y4)
D5: D16.1(A) U15.14(Y5)
D6: D17.1(A) U15.13(Y6)
D7: D18.1(A) U15.12(Y7)
D8: D19.1(A) U15.11(Y8)
D_Buf: P10.4 U1.44(IO_L20P_6) U6.5(A4)
DD4: LCD1.11(D4) U3.36(PB15)
DD5: LCD1.12(D5) U3.35(PB14)
DD6: LCD1.13(D6) U3.34(PB13)
DD7: LCD1.14(D7) U3.33(PB12)
DIN_92: U1.92(IO_L27N_4/DIN/D0) U11.1(D0)
DX_1: P14.1 U1.29(IO_L40N_6) U15.2(A1)
DX_2: P14.2 U1.28(IO_L40P_6/VREF_6) U15.3(A2)
DX_3: P14.3 U1.27(IO_L40N_7/VREF_7) U15.4(A3)
DX_4: P14.4 U1.26(IO_L40P_7) U15.5(A4)
DX_5: P14.5 U1.24(IO_L39N_7) U15.6(A5)
DX_6: P14.6 U1.22(IO_L39P_7) U15.7(A6)
DX_7: P14.7 U1.21(IO_L24N_7) U15.8(A7)
DX_8: P14.8 U1.20(IO_L24P_7) U15.9(A8)
E: U6.14(Y5) U7.7(E)
E_Buf: P10.5 U1.45(IO_L20N_6) U6.6(A5)
E_LCD: LCD1.6(E) U3.37(PC6)
F: U6.13(Y6) U7.3(F)
F_Buf: P10.6 U1.46(IO_L19P_6) U6.7(A6)
FTOU: U1.101(IO_L01N_4/VRP_4) U3.61(PB8)
G: U6.12(Y7) U7.11(G)
G_Buf: P10.7 U1.48(IO_L19N_6) U6.8(A7)
GREEN0: R54.2 U1.71(IO)
GREEN1: R53.2 U1.68(IO_L28N_5/D6)
GREEN2: R52.2 U1.67(IO_L28P_5/D7)
GREEN3: R50.2 U1.65(IO_L27N_5/VREF_5)
HSYNC: R37.2 U1.57(IO_L01P_5/CS_B)
I/O_P79_GCLK0: OSC1.3(OUT) U1.79(IO_L32P_4/GCLK0)
INT_B_83: R27.1 R31.1 U1.83(IO_L31N_4/INIT_B) U1.103(DONE) U11.10(~{CE})
IO0: U1.175(IO) U13.7(I/O0)
IO1: U1.172(IO_L28N_1) U13.8(I/O1)
IO2: U1.171(IO_L28P_1) U13.9(I/O2)
IO3: U1.169(IO_L27N_1) U13.10(I/O3)
IO4: U1.168(IO_L27P_1) U13.13(I/O4)
IO5: U1.167(IO) U13.14(I/O5)
IO6: U1.166(IO_L10N_1/VREF_1) U13.15(I/O6)
IO7: U1.165(IO_L10P_1) U13.16(I/O7)
IO8: U1.204(IO_L01N_0/VRP_0) U13.29(I/O8)
IO9: U1.203(IO_L01P_0/VRN_0) U13.30(I/O9)
IO10: U1.200(IO/VREF_0) U13.31(I/O10)
IO11: U1.199(IO_L25N_0) U13.32(I/O11)
IO12: U1.198(IO_L25P_0) U13.35(I/O12)
IO13: U1.197(IO) U13.36(I/O13)
IO14: U1.196(IO_L27N_0) U13.37(I/O14)
IO15: U1.194(IO_L27P_0) U13.38(I/O15)
K_1: P7.1 S1.1(A1) U1.10(IO_L20P_7)
K_2: P7.2 S1.2(A2) U1.11(IO_L20N_7)
K_3: P7.3 S1.3(A3) U1.12(IO_L21P_7)
K_4: P7.4 S1.4(A4) U1.13(IO_L21N_7)
K_5: P7.5 S1.5(A5) U1.15(IO_L22P_7)
K_6: P7.6 S1.6(A6) U1.16(IO_L22N_7)
K_7: P7.7 S1.7(A7) U1.18(IO_L23P_7)
K_8: P7.8 S1.8(A8) U1.19(IO_L23N_7)
LB: U1.191(IO_L30N_0) U13.39(~{LB})
MOTOR_1: P3.8 U1.39(IO_L22P_6) U2.8(IN8)
NRST: C41.2 P4.3 R8.1 S3.2 U3.7(NRST)
OE: U1.189(IO) U13.41(~{OE})
OSC_IN: C24.2 U3.5(OSC_IN/PD0) Y1.2(OSC2)
OSC_OUT: C33.2 U3.6(OSC_OUT/PD1) Y1.1(OSC1)
P1: P9.1 U3.45(PA12)
P2: P9.7 U3.26(PB0)
P3: P9.6 U3.27(PB1)
P4: P9.5 R3.2 U3.28(PB2/BOOT1)
P5: P9.4 U3.29(PB10)
P6: P9.3 U3.30(PB11)
P7: P9.13 U3.8(PC0)
P8: P9.12 U3.9(PC1)
P9: P9.11 U3.10(PC2)
P10: P9.10 U3.11(PC3)
P11: P9.9 U3.24(PC4)
P12: P9.8 U3.25(PC5)
P13: P9.2 U3.40(PC9)
P14: P9.16 U3.2(PC13-TAMPER-RTC)
P15: P9.15 U3.3(PC14-OSC32_IN)
P16: P9.14 U3.4(PC15-OSC32_OUT)
PA2: U1.115(IO_L20N_3) U3.16(PA2)
PA3: U1.114(IO_L20P_3) U3.17(PA3)
PA4: U1.113(IO_L19N_3) U3.20(PA4)
PA5: U1.111(IO_L19P_3) U3.21(PA5)
PA6: U1.109(IO_L17N_3) U3.22(PA6)
PA7: U1.108(IO_L17P_3/VREF_3) U3.23(PA7)
PA8: U1.107(IO_L01N_3/VRP_3) U3.41(PA8)
PA11: U1.106(IO_L01P_3/VRN_3) U3.44(PA11)
PB50: U1.147(IO_L21N_2) U3.50(PA15/JTDI)
PB55: U1.138(IO_L24P_2) U3.57(PB5)
PB56: U1.139(IO_L24N_2) U3.56(PB4/JNTRST)
PB57: U1.140(IO_L23P_2) U3.55(PB3/JTDO)
PC51: U1.143(IO_L22P_2) U3.53(PC12)
PC52: U1.144(IO_L22N_2) U3.52(PC11)
PC53: U1.146(IO_L21P_2) U3.51(PC10)
PC54: U1.141(IO_L23N_2/VREF_2) U3.54(PD2)
PP81: P11.24 U1.80(IO_L32N_4/GCLK1)
PP85: P11.23 U1.81(IO_L31P_4/DOUT/BUSY)
PP86: P11.22 U1.85(IO/VREF_4)
PP87: P11.21 U1.86(IO_L30P_4/D3)
PP90: P11.20 U1.87(IO_L30N_4/D2)
PP93: P11.19 U1.90(IO_L27P_4/D1)
PP94: P11.18 U1.93(IO)
PP95: P11.17 U1.94(IO_L25P_4)
PP96: P11.16 U1.95(IO_L25N_4)
PP97: P11.15 U1.96(IO/VREF_4)
PP100: P11.14 U1.97(IO)
PP122: P11.13 U1.100(IO_L01P_4/VRN_4)
PP123: P11.12 U1.122(IO_L23P_3/VREF_3)
PP124: P11.11 U1.123(IO_L23N_3)
PP125: P11.10 U1.124(IO_L24P_3)
PP126: P11.9 U1.125(IO_L24N_3)
PP128: P11.8 U1.126(IO_L39P_3)
PP130: P11.7 U1.128(IO_L39N_3)
PP131: P11.6 U1.130(IO_L40P_3)
PP132: P11.5 U1.131(IO_L40N_3/VREF_3)
PP133: P11.4 U1.132(IO_L40P_2/VREF_2)
PP135: P11.3 U1.133(IO_L40N_2)
PP147: P11.2 U1.135(IO_L39P_2)
PP148: P11.1 U1.137(IO_L39N_2)
RED0: R61.2 U1.77(IO_L32N_5/GCLK3)
RED1: R58.2 U1.76(IO_L32P_5/GCLK2)
RED2: R57.2 U1.74(IO_L31N_5/D4)
RED3: R55.2 U1.72(IO_L31P_5/D5)
REL_1: P3.5 U1.36(IO_L23P_6) U2.5(IN5)
REL_2: P3.6 U1.37(IO_L23N_6) U2.6(IN6)
RS: LCD1.4(RS) U3.39(PC8)
RW: LCD1.5(RW) U3.38(PC7)
RX_232: U1.7(IO_L19P_7) U17.12(R1OUT)
RXD0(PA9): U3.42(PA9) U10.1(TXD)
RXD_FT2232/MPSSE_TDI: U1.148(IO_L20P_2) U14.39(BDBUS1)
S1: R10.1 U7.12(S1)
S2: R11.1 U7.5(S2)
S3: R17.1 U7.4(S3)
S4: R18.1 U7.1(S4)
SCL: R25.2 U3.58(PB6) U9.6(SCL)
SDA: R24.2 U3.59(PB7) U9.5(SDA)
SO1: R12.1 U1.116(IO_L21P_3)
SO2: R13.1 U1.117(IO_L21N_3)
SO3: R19.1 U1.119(IO_L22P_3)
SO4: R20.1 U1.120(IO_L22N_3)
STEP_1: P3.1 U1.31(IO_L39P_6) U2.1(IN1)
STEP_2: P3.2 U1.33(IO_L39N_6) U2.2(IN2)
STEP_3: P3.3 U1.34(IO_L24P_6) U2.3(IN3)
STEP_4: P3.4 U1.35(IO_L24N_6/VREF_6) U2.4(IN4)
SWCLK: P4.2 R2.1 U3.49(PA14/JTCK/SWCLK)
SWDIO: P4.1 R1.1 U3.46(PA13/JTMS/SWDIO)
TCK: P12.1 R34.2 U1.159(TCK) U14.16(ADBUS0)
TDI: P12.9 U11.4(TDI) U14.17(ADBUS1)
TDO: P12.3 U1.158(TDO) U14.18(ADBUS2)
TMS: P12.5 R35.2 U1.160(TMS) U14.19(ADBUS3)
TX_232: U1.9(IO_L19N_7/VREF_7) U17.11(T1IN)
TXD0(PA10): U3.43(PA10) U10.5(RXD)
TXD_FT2232/MPSSE_TCK: U1.149(IO_L20N_2) U14.38(BDBUS0)
UB: U1.190(IO_L30P_0) U13.40(~{UB})
UTOF: U1.102(IO/VREF_4) U3.62(PB9)
VSYNC: R38.2 U1.58(IO_L01N_5/RDWR_B)
WE: U1.162(IO_L01N_1/VRP_1) U13.17(~{WE})
NetC35_2: C35.2 D3.2(K) U4.1(VIN)
NetC52_2: C52.2 U10.17(3V3OUT)
NetC62_2: C62.2 C64.2 L4.2 U14.9(VPLL)
NetC63_2: C63.2 C65.2 L5.2 U14.4(VPHY)
NetC71_1: C71.1 U17.1(C1+)
NetC71_2: C71.2 U17.3(C1-)
NetC72_2: C72.2 U17.2(V+)
NetC73_1: C73.1 U17.4(C2+)
NetC73_2: C73.2 U17.5(C2-)
NetC75_2: C75.2 U14.2(OSCI) Y2.1(OSC1)
NetC77_2: C77.2 U17.6(V-)
NetC78_2: C78.2 U14.3(OSCO) Y2.2(OSC2)
NetD1_1: D1.1(A) R4.1
NetD1_2: D1.2(K) K1.5(T2) U2.14(OUT5)
NetD2_1: D2.1(A) R5.1
NetD2_2: D2.2(K) K2.5(T2) U2.13(OUT6)
NetD3_1: D3.1(A) S2.2(NO)
NetD4_1: D4.1(A) R7.1
NetD5_2: D5.2(K) L3.1 U4.2(OUT)
NetD6_1: D6.1(A) R14.1
NetD7_1: D7.1(A) R23.1
NetD8_1: D8.1(A) R31.2
NetD9_1: D9.1(A) R29.1
NetD9_2: D9.2(K) U10.23(CBUS0)
NetD10_1: D10.1(A) R30.1
NetD10_2: D10.2(K) U10.22(CBUS1)
NetD11_1: D11.1(A) R32.1
NetD12_2: D12.2(K) P13.1
NetD13_2: D13.2(K) P13.2
NetD14_2: D14.2(K) P13.3
NetD15_2: D15.2(K) P13.4
NetD16_2: D16.2(K) P13.5
NetD17_2: D17.2(K) P13.6
NetD18_2: D18.2(K) P13.7
NetD19_2: D19.2(K) P13.8
NetJ1_1: J1.1 R55.1 R57.1 R58.1 R61.1
NetJ1_2: J1.2 R50.1 R52.1 R53.1 R54.1
NetJ1_3: J1.3 R44.1 R45.1 R47.1 R49.1
NetJ1_13: J1.13 R37.1
NetJ1_15: J1.15 R38.1
NetJ2_2: J2.2 U17.14(T1OUT)
NetJ2_3: J2.3 U17.13(R1IN)
NetK1_1: K1.1(COM) P2.2
NetK1_2: K1.2(NC) P2.1
NetK1_3: K1.3(NO) P2.3
NetK2_1: K2.1(COM) P5.2
NetK2_2: K2.2(NC) P5.1
NetK2_3: K2.3(NO) P5.3
NetL6_1: L6.1 USB2.1(VCC)
NetLCD1_3: LCD1.3(VO) R6.3(TAP)
NetLS1_2: LS1.2 U2.12(OUT7)
NetOSC1_1: OSC1.1(E/D) R56.1
NetP1_1: P1.1 U2.18(OUT1)
NetP1_2: P1.2 U2.17(OUT2)
NetP1_3: P1.3 U2.16(OUT3)
NetP1_4: P1.4 U2.15(OUT4)
NetP6_2: P6.2 U2.11(OUT8)
NetP8_2: P8.2 S2.1(COMMON)
NetQ1_2: Q1.2(E) R12.2 R15.1
NetQ1_3: Q1.3(C) R10.2
NetQ2_2: Q2.2(E) R13.2 R16.1
NetQ2_3: Q2.3(C) R11.2
NetQ3_2: Q3.2(E) R19.2 R21.1
NetQ3_3: Q3.3(C) R17.2
NetQ4_2: Q4.2(E) R20.2 R22.1
NetQ4_3: Q4.3(C) R18.2
NetR26_1: R26.1 U11.8(OE/~{RESET})
NetR28_1: R28.1 S5.1 U1.207(PROG_B) U11.7(~{CF})
NetR33_1: R33.1 U11.17(TDO)
NetR33_2: R33.2 U1.208(TDI)
NetR34_1: R34.1 U11.6(TCK)
NetR35_1: R35.1 U11.5(TMS)
NetR43_1: R43.1 USB2.2(D-)
NetR43_2: R43.2 U14.7(DM)
NetR46_1: R46.1 USB2.3(D+)
NetR46_2: R46.2 U14.8(DP)
NetR48_2: R48.2 U14.14(RESET#)
NetR51_2: R51.2 U14.6(REF)
NetR59_2: R59.2 R60.1 U16.4(DO)
NetR60_2: R60.2 U14.61(EEDATA) U16.3(DI)
NetU1_104: U1.104(CCLK) U11.3(CLK)
NetU10_15: U10.15(USBDP) USB1.3(D+)
NetU10_16: U10.16(USBDM) USB1.2(D-)
NetU14_62: U14.62(EECLK) U16.2(CLK)
NetU14_63: U14.63(EECS) U16.1(CS)

Not connected (* = marked no-connect by the designer): J1 4* 9* 12* 14* 16(MH1)* 17(MH2)*; J2 1* 4* 5* 6* 7* 8* 9* 10(MH1)* 11(MH2)*; LCD1 7(D0)* 8(D1)* 9(D2)* 10(D3)*; P12 6* 7* 8*; U1 161(IO_L01P_1/VRN_1)*; U10 2(DTR#)* 3(RTS#)* 6(RI#)* 8(NC)* 9(DSR#)* 10(DCD#)* 11(CTS#)* 12(CBUS4)* 13(CBUS2)* 14(CBUS3)* 19(RESET#)* 24(NC)* 27(OCSI)* 28(OCSO)*; U11 2(DNC)* 9(DNC)* 12(DNC)* 13(~{CEO})* 14(DNC)* 15(DNC)* 16(DNC)*; U13 28(NC)*; U14 21(ADBUS4)* 22(ADBUS5)* 23(ADBUS6)* 24(ADBUS7)* 26(ACBUS0)* 27(ACBUS1)* 28(ACBUS2)* 29(ACBUS3)* 30(ACBUS4)* 32(ACBUS5)* 33(ACBUS6)* 34(ACBUS7)* 36(SUSPEND#)* 40(BDBUS2)* 41(BDBUS3)* 43(BDBUS4)* 44(BDBUS5)* 45(BDBUS6)* 46(BDBUS7)* 48(BCBUS0)* 52(BCBUS1)* 53(BCBUS2)* 54(BCBUS3)* 55(BCBUS4)* 57(BCBUS5)* 58(BCBUS6)* 59(BCBUS7)* 60(PWREN#)*; U16 6(NC)* 7(NC)*; U17 7(T2OUT)* 8(R2IN)* 9(R2OUT)* 10(T2IN)*; USB1 4(NC)*; USB2 4(NC)*

## Notes on the sheet
- FPGA/ BANK
- MOTOR_BUZZER_RELAY
- MICRO CONTROLLER
- XC3S400-4PQ208C
- VCC
- ARM CORTEX M3
- LCD
- FPGA POWER
- (DC-12 V TO 5V) 2-3A
- DIP SWITCH
- I/O
- 7-SEG
- (near U5) (5V TO 3.3V)
- (near U8) (3.3V TO 2.5V)
- (near C50) FLASH-2M
- EEPROM12C
- USB TO SERIAL PORT(TO MC)
- FT232RL
- (5V TO 1.2V)
- (near U13) RAM-IS61LV25616AL
- (near L4) FT2232HL-REEL(USB TO JTAG)
- JTAG
- GND
- (near C66) PUSH BUTTON
- VGA PORT
- OSCILLATOR-50M
- LED
- (near C71) UART
- EEPROM-1K-BIT 128x8
- 93LC46A-E/SN
- 93C56R-256x8(2k)
- 93C66R-93C66-512x8(4k)
- (in symbol Component_1) 0.0.0.0
- (in symbol XC3S400-4PQ208C, part A) BANK 0
- (in symbol XC3S400-4PQ208C, part B) BANK 1
- (in symbol XC3S400-4PQ208C, part C) BANK 2
- (in symbol XC3S400-4PQ208C, part D) BANK 3
- (in symbol XC3S400-4PQ208C, part E) BANK 4
- (in symbol XC3S400-4PQ208C, part F) BANK 5
- (in symbol XC3S400-4PQ208C, part G) BANK 6
- (in symbol XC3S400-4PQ208C, part H) BANK 7

## Library data of the parts
C1-C42 C44 C45 C47-C52 C54-C70 C74-C76 C78 = Cap: Capacitor; Published: 8-Jun-2000; LatestRevisionDate: 17-Jul-2002; LatestRevisionNote: Re-released for DXP Platform.; PackageReference: RAD-0.3; Publisher: Altium Limited; PackageDescription: Radial Cap, Thru-Hole; 2 Leads; 0.3 in Pin Spacing
C43 C46 C53 = Cap Pol3: Polarized Capacitor (Surface Mount); Published: 8-Jun-2000; LatestRevisionDate: 29-May-2009; LatestRevisionNote: IPC-7351 Footprint Added.; PackageReference: C0805; Publisher: Altium Limited; PackageDescription: Chip Capacitor
C71-C73 C77 = Cap Pol2: Polarized Capacitor (Axial); Published: 8-Jun-2000; LatestRevisionDate: 17-Jul-2002; LatestRevisionNote: Re-released for DXP Platform.; PackageReference: POLAR0.8; Publisher: Altium Limited; PackageDescription: Polarized Capacitor; 2 Leads
D1 D2 D4 D6-D19 = LED0: Typical INFRARED GaAs LED; Published: 8-Jun-2000; LatestRevisionDate: 08-Jul-2005; LatestRevisionNote: Mech Layer 1 removed.; PackageReference: LED-0; Publisher: Altium Limited; PackageDescription: LED; 2 Leads
D3 = Diode 1N4001: 1 Amp General Purpose Rectifier; Published: 8-Jun-2000; LatestRevisionDate: 17-Jul-2002; LatestRevisionNote: Re-released for DXP Platform.; DatasheetVersion: 1998; PackageVersion: Aug-1999; PackageReference: DO-41; Publisher: Altium Limited; PackageDescription: Diode, Axial; Body 5.2 x 2.7 mm (LxDia. max), Lead Dia. 0.86 mm (max); Code_JEDEC: DO-204-AL; ComponentLink1Description: Manufacturer Link; ComponentLink1URL: http://www.fairchildsemi.com/; ComponentLink2Description: Datasheet; ComponentLink2URL: http://www.fairchildsemi.com/ds/1N%2F1N4001.pdf
D5 = Diode 11DQ03: Schottky Rectifier; Published: 8-Jun-2000; LatestRevisionDate: 17-Jul-2002; LatestRevisionNote: Re-released for DXP Platform.; DatasheetVersion: Dec-1997; PackageReference: DO-204AL; Publisher: Altium Limited; PackageDescription: Diode, Axial; Body 5.2 x 2.7 mm (LxDia. max), Lead Dia. 0.86 mm (max); Code_JEDEC: DO-204-AL; ComponentLink1Description: Manufacturer Link; ComponentLink1URL: http://www.irf.com/; ComponentLink2Description: Datasheet; ComponentLink2URL: http://www.irf.com/product-info/datasheets/data/11dq03.pdf
J1 = Connector 15: Receptacle Assembly, 15-Pin, Sim Line Connector; PackageDocument: B; Positions: 15; Gender: Receptacle Header; Published: 15-Jun-2001; LatestRevisionDate: 17-Jul-2002; LatestRevisionNote: Re-released for DXP Platform.; DatasheetDocument: 24-Nov-1999; PackageReference: 788574; Publisher: Altium Limited; Orientation: Right Angle
J2 = D Connector 9: Receptacle Assembly, 9 Position, Right Angle; PackageDocument: O; Positions: 9; Published: 15-Jun-2001; LatestRevisionDate: 17-Jul-2002; LatestRevisionNote: Re-released for DXP Platform.; DatasheetDocument: 1-Sep-1999; PackageReference: 788750; Publisher: Altium Limited; Orientation: Right Angle; Gender: Receptacle
K1 K2 = Relay: SPDT Relay; Published: 8-Jun-2000; LatestRevisionDate: 17-Jul-2002; LatestRevisionNote: Re-released for DXP Platform.; PackageReference: MODULE5B; Publisher: Altium Limited
L1-L6 = Inductor: Code_IEC: 1005; Published: 8-Jun-2000; LatestRevisionDate: 29-May-2009; LatestRevisionNote: IPC-7351 Footprint Added.; PackageReference: 0402-A; Publisher: Altium Limited; PackageDescription: Chip Inductor; Code_JEITA: 0402
LS1 = Speaker: Loudspeaker; Published: 24-Mar-1999; LatestRevisionDate: 17-Jul-2002; LatestRevisionNote: Re-released for DXP Platform.; PackageReference: PIN2; Publisher: Altium Limited
OSC1 = Component_1: Designer:: Mohammad Ansari
P1 P4 = Header 5: Header, 5-Pin; LatestRevisionDate: 17-Jul-2002; LatestRevisionNote: Re-released for DXP Platform.; Publisher: Altium Limited
P2 P5 = Header 3: Header, 3-Pin; LatestRevisionDate: 17-Jul-2002; LatestRevisionNote: Re-released for DXP Platform.; Publisher: Altium Limited
P3 P7 P10 P13 P14 = Header 9: Header, 9-Pin; LatestRevisionDate: 17-Jul-2002; LatestRevisionNote: Re-released for DXP Platform.; Publisher: Altium Limited
P6 P8 = Header 2: Header, 2-Pin; LatestRevisionDate: 17-Jul-2002; LatestRevisionNote: Re-released for DXP Platform.; Publisher: Altium Limited
P9 = Header 9X2: Header, 9-Pin, Dual row; LatestRevisionDate: 17-Jul-2002; LatestRevisionNote: Re-released for DXP Platform.; Publisher: Altium Limited
P11 = Header 14X2: Header, 14-Pin, Dual row; LatestRevisionDate: 17-Jul-2002; LatestRevisionNote: Re-released for DXP Platform.; Publisher: Altium Limited
P12 = Header 5X2: Header, 5-Pin, Dual row; LatestRevisionDate: 17-Jul-2002; LatestRevisionNote: Re-released for DXP Platform.; Publisher: Altium Limited
Q1-Q4 = 2N3904: NPN General Purpose Amplifier; Published: 8-Jun-2000; LatestRevisionDate: 15-Jan-2003; LatestRevisionNote: PCB Footprint 'BCY-W3/D4.7' replaced; DatasheetVersion: 1997; PackageVersion: Sep-1998; PackageReference: TO-92A; Publisher: Altium Limited; Code_JEDEC: TO-92A; ComponentLink1Description: Manufacturer Link; ComponentLink1URL: http://www.fairchildsemi.com/; ComponentLink2Description: Datasheet; ComponentLink2URL: http://www.fairchildsemi.com/ds/2N%2F2N3904.pdf
R1-R5 R7-R61 = Res1: Resistor; Published: 8-Jun-2000; LatestRevisionDate: 17-Jul-2002; LatestRevisionNote: Re-released for DXP Platform.; PackageReference: AXIAL-0.3; Publisher: Altium Limited
  R1-R5 R7-R9 R14 R23 R26-R61: PackageDescription: Axial Device, Thru-Hole; 2 Leads; 0.3 in Pin Spacing
R6 = RPot: Potentiometer; Sim Note: Enter the Resistance value and the set point into parameter fields.; Set Position: 0.5; Published: 8-Jun-2000; LatestRevisionDate: 17-Jul-2002; LatestRevisionNote: Re-released for DXP Platform.; PackageReference: VR5; Publisher: Altium Limited; PackageDescription: Variable Resistor, Thru-Hole; 3 Leads
S1 = SW DIP-8: DIP Switch, 8 Position, SPST; Published: 24-Mar-1999; LatestRevisionDate: 17-Jul-2002; LatestRevisionNote: Re-released for DXP Platform.; PackageReference: DIP_SW_8WAY_SMD; Publisher: Altium Limited; PackageDescription: DIP Switch; 16 Leads
S2 S4 = SW-SPST: Single-Pole, Single-Throw Switch; Published: 24-Mar-1999; LatestRevisionDate: 17-Jul-2002; LatestRevisionNote: Re-released for DXP Platform.; PackageReference: SPST-2; Publisher: Altium Limited; PackageDescription: Switch; 2 Leads
S3 S5-S9 = SW-PB: Switch; Published: 24-Mar-1999; LatestRevisionDate: 17-Jul-2002; LatestRevisionNote: Re-released for DXP Platform.; PackageReference: SPST-2; Publisher: Altium Limited; PackageDescription: Switch; 2 Leads
U1 = XC3S400-4PQ208C: Spartan-3 1.2V FPGA, 141 User I/Os, 208-Pin PQFP, Standard Performance, Commercial Grade; Ordering Information: Additional code may have to be appended for different mask revision devices.; FirstPublished: 17-Sep-2003; LatestRevisionDate: 05-Mar-2009; LatestRevisionNote: Updated to datasheet version 2.4 Jun-2008.; DatasheetVersion: ver2.4, Jun-2008; PackageVersion: ver1.2, Jun-2004; PackageReference: PQ208; Publisher: Altium Limited; PackageDescription: 208-Pin Plastic Quad Flat Pack (PQ208); Supplier 1: Digi-Key; Supplier Part Number 1: XC3S400-4PQ208C-ND; Code_JEDEC: MS-029-FA-1; ComponentLink1Description: Spartan-3 Datasheet; ComponentLink1URL: http://www.xilinx.com/support/documentation/data_sheets/ds099.pdf; ComponentLink2Description: PQ208 Package Drawing; ComponentLink2URL: http://www.xilinx.com/support/documentation/package_specs/pq208.pdf; ComponentLink3Description: Spartan-3 Documents; ComponentLink3URL: http://www.xilinx.com/support/documentation/spartan-3.htm; ComponentLink4Description: Xilinx.com Home; ComponentLink4URL: http://www.xilinx.com
U2 = ULN2803A: High-Voltage, High-Current Darlington Array; Published: 13-Oct-2000; LatestRevisionDate: 06-Jun-2005; LatestRevisionNote: Stylized 3D Model Added.; DatasheetVersion: 1999; PackageVersion: 1999; PackageReference: A18; Publisher: Altium Limited; PackageDescription: DIP; 18 Leads; Row Spacing 7.62 mm; Pitch 2.54 mm; ComponentLink1Description: Manufacturer Link; ComponentLink1URL: http://www.allegromicro.com/
U3 = STM32F103RBT6: STM32 ARM-based 32-bit MCU with 128 Kbytes Flash, 64-pin LQFP, Industrial Temperature; Published: 30-May-2008; DatasheetVersion: rev6, Mar-2008; PackageVersion: Mar-2008; PackageReference: LQFP64; Publisher: Altium Limited; PackageDescription: 64-Pin Low-Profile Quad Flat Pack, 10 x 10 mm Body, 0.5 mm Pitch (LQFP64); ComponentLink1Description: Manufacturer Link; ComponentLink1URL: www.st.com/stm32; ComponentLink2Description: Datasheet; ComponentLink2URL: http://www.st.com/stonline/products/literature/ds/13587.pdf
U4 = LM2576HVT-3.3: SIMPLE SWITCHER; 3A Step-Down Voltage Regulator; Manufacturer: National Semiconductor; PackageTopMarking: NSUZXYTT*LM2576HVT*-3.3 P+; Published: 4-Dec-2008; DatasheetVersion: Aug-2004; PackageVersion: revJ, Jan-1992; PackageReference: T05A; Publisher: Altium Limited; PackageDescription: TO-220, Molded, 5 Lead, Straight; CompType: Switcher; PartNumber: LM2576HVT-3.3; RoHS: Y; PinCount: 5; DigiKeyPartNumber: LM2576HVT-3.3-ND; Code_JEDEC: TO-220-AB; ComponentLink1Description: LM2576HV Datasheet; ComponentLink1URL: http://www.national.com/ds/LM/LM2576HV.pdf; ComponentLink2Description: LM2576HV Web Page; ComponentLink2URL: http://www.national.com/pf/LM/LM2576HV.html; ComponentLink3Description: T05A Package Page; ComponentLink3URL: http://www.national.com/packaging/folders/t05a.html
U5 U7 U8 U12 = Component_1
U6 U15 = M74HC541B1R: Octal Bus Buffer with 3 State Outputs (Non Inverted); Published: 8-Jun-2000; LatestRevisionDate: 06-Jun-2005; LatestRevisionNote: Stylized 3D Model Added.; DatasheetVersion: Oct-1993; PackageVersion: Jun-1998; PackageReference: DIP20; Publisher: Altium Limited; PackageDescription: DIP; 20 Leads; Row Spacing 7.62 mm; Pitch 2.54 mm; Code_JEDEC: MS-015-AE; ComponentLink1Description: Manufacturer Link; ComponentLink1URL: http://www.st.com/
U11 = XCF02SVO20C: XCF00S Series, Platform Flash In-System Programmable Configuration 3.3V PROM, 20-Pin TSOP, 2-Megabit, Commercial Grade; FirstPublished: 17-Sep-2003; LatestRevisionDate: 16-Nov-2009; LatestRevisionNote: Updated to datasheet version 2.17, Oct-2009.; DatasheetVersion: ver2.17, Oct-2009; PackageVersion: ver1.3, Dec-2008; PackageReference: VO20; Publisher: Altium Limited; PackageDescription: 20-Pin Thin Shrink Small Outline Package (VO20); Supplier 1: Digi-Key; Supplier Part Number 1: XCF02SVO20C-ND; Code_JEDEC: MO-153-AC; ComponentLink1Description: Platform Flash Datasheet; ComponentLink1URL: http://www.xilinx.com/support/documentation/data_sheets/ds123.pdf; ComponentLink2Description: VO20 Package Drawing; ComponentLink2URL: http://www.xilinx.com/support/documentation/package_specs/vo20.pdf; ComponentLink3Description: Configuration PROM Documents; ComponentLink3URL: http://www.xilinx.com/support/documentation/configuration_proms.htm; ComponentLink4Description: Xilinx.com Home; ComponentLink4URL: http://www.xilinx.com
U14 = FT2232HL-Reel: Dual High Speed USB To Multipurpose UART/FIFO IC, LQFP-64, Tape and Reel; Published: 19-Aug-2010; DatasheetVersion: ver 2.08, May-2010; PackageVersion: 2010; PackageReference: LQFP-64; Publisher: Altium Limited; PackageDescription: 64-Pin Thin Quad Flat Pack, 10 x 10 x 1.4 mm Body, 0.5 mm Pitch; ComponentLink1Description: Manufacturer Link; ComponentLink1URL: http://www.ftdichip.com/Products/ICs/FT2232H.htm; ComponentLink2Description: Datasheet; ComponentLink2URL: http://www.ftdichip.com/Support/Documents/DataSheets/ICs/DS_FT2232H.pdf
U16 = 93LC46A-E/SN: 1K, 128x8-bit, 2.5V Microwire Serial EEPROM, 8-Pin SOIC 150mil, Extended Temperature; ComponentAvailability: Unknown. Contact manufacturer to determine status.; Published: 29-Jan-2009; DatasheetVersion: revG, May-2008; PackageVersion: revBB, Aug-2009; PackageReference: SOIC-SN8; Publisher: Altium Limited; PackageDescription: 8-Lead Plastic Small Outline (SN) - Narrow, 3.90mm Body [SOIC]; Supplier 1: Digi-Key; Supplier Part Number 1: 93LC46A-E/SN-ND; Code_JEDEC: MS-012; Code_IPC: SOIC127P600-8; ComponentLink1Description: Datasheet; ComponentLink1URL: http://ww1.microchip.com/downloads/en/DeviceDoc/21749G.pdf; ComponentLink2Description: Packaging Specification; ComponentLink2URL: http://www.microchip.com/stellent/groups/techpub_sg/documents/packagingspec/en012702.pdf; ComponentLink3Description: Microchip.com Home; ComponentLink3URL: http://www.microchip.com/
U17 = MAX3232CPE: 3.0V TO 5.5V, Low-Power, up to 1Mbps, True RS-232 Transceiver Using Four 0.1µF External Capacitor; Published: 16-Jan-2001; LatestRevisionDate: 29-May-2009; LatestRevisionNote: Component Body Added.; DatasheetVersion: Mar-1999; PackageVersion: Aug-2000; PackageReference: PE16; Publisher: Altium Limited; PackageDescription: DIP, 16-Pin, Row Spacing 7.62 mm, Pitch 2.54 mm; Code_JEDEC: MS-001-BB; ComponentLink1Description: Manufacturer Link; ComponentLink1URL: http://www.maxim-ic.com/; ComponentLink2Description: Datasheet; ComponentLink2URL: http://pdfserv.maxim-ic.com/en/ds/MAX3222-MAX3241.pdf
Y1 Y2 = XTAL: Crystal Oscillator; Published: 8-Jun-2000; LatestRevisionDate: 17-Jul-2002; LatestRevisionNote: Re-released for DXP Platform.; PackageReference: R38; Publisher: Altium Limited; PackageDescription: Crystal, Thru-Hole; 2 Leads; Body 3.1 x 8.2 mm (Dia.xH)